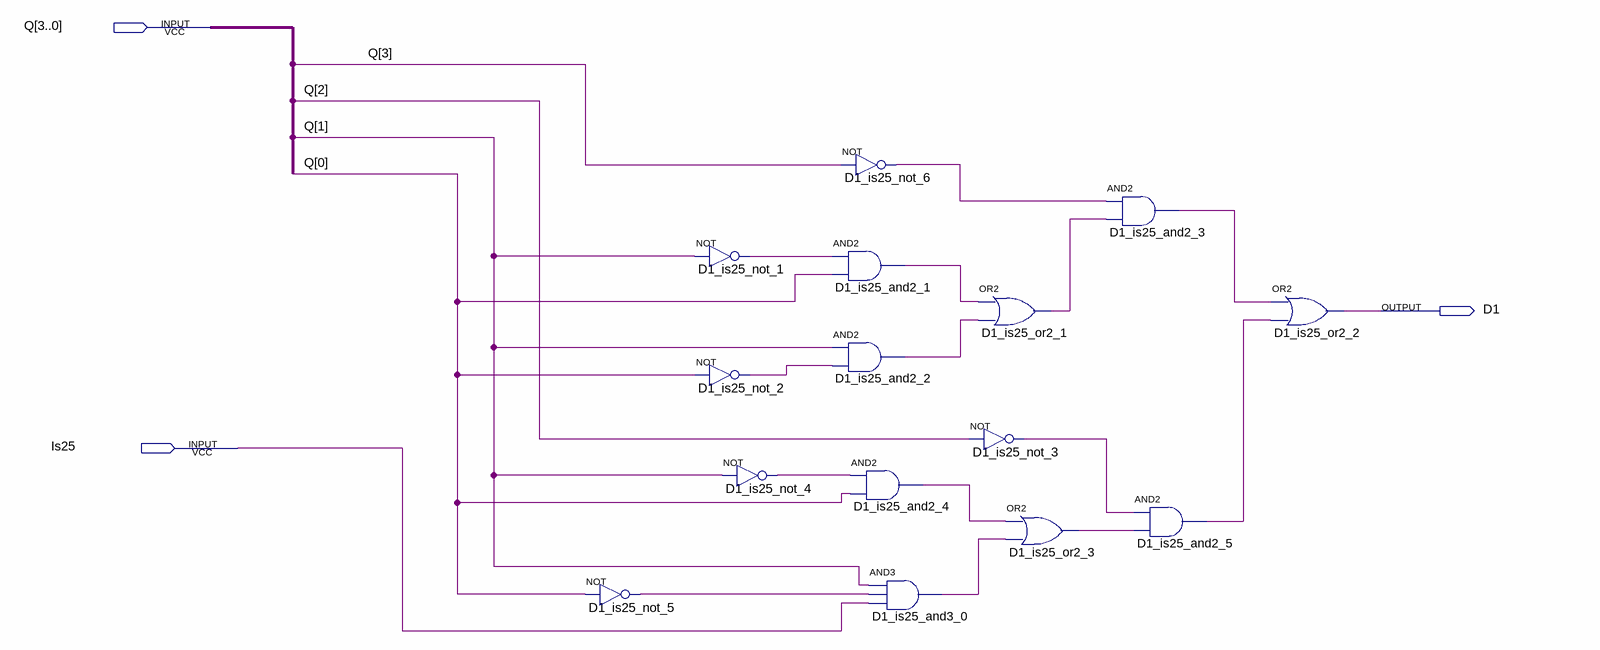
[diagram p0: schematic sheet]
// Quartus schematic D1.bdf as structural Verilog: 15 symbols, 3 pins
module D1 (
  input  [3:0] Q,
  input  Is25,
  output D1
);

  wire D1_is25_and2_1_out, D1_is25_and2_2_out, D1_is25_and2_3_out, D1_is25_and2_4_out, D1_is25_and2_5_out,
       D1_is25_and3_0_out, D1_is25_not_1_out, D1_is25_not_2_out, D1_is25_not_3_out, D1_is25_not_4_out,
       D1_is25_not_5_out, D1_is25_not_6_out, D1_is25_or2_1_out, D1_is25_or2_3_out;

  not D1_is25_not_5 (D1_is25_not_5_out, Q[0]);
  not D1_is25_not_1 (D1_is25_not_1_out, Q[1]);
  not D1_is25_not_2 (D1_is25_not_2_out, Q[0]);
  not D1_is25_not_4 (D1_is25_not_4_out, Q[1]);
  not D1_is25_not_6 (D1_is25_not_6_out, Q[3]);
  and D1_is25_and2_1 (D1_is25_and2_1_out, D1_is25_not_1_out, Q[0]);
  and D1_is25_and2_2 (D1_is25_and2_2_out, Q[1], D1_is25_not_2_out);
  and D1_is25_and2_4 (D1_is25_and2_4_out, D1_is25_not_4_out, Q[0]);
  and D1_is25_and3_0 (D1_is25_and3_0_out, Q[1], D1_is25_not_5_out, Is25);
  or D1_is25_or2_1 (D1_is25_or2_1_out, D1_is25_and2_1_out, D1_is25_and2_2_out);
  not D1_is25_not_3 (D1_is25_not_3_out, Q[2]);
  or D1_is25_or2_3 (D1_is25_or2_3_out, D1_is25_and2_4_out, D1_is25_and3_0_out);
  and D1_is25_and2_3 (D1_is25_and2_3_out, D1_is25_not_6_out, D1_is25_or2_1_out);
  and D1_is25_and2_5 (D1_is25_and2_5_out, D1_is25_not_3_out, D1_is25_or2_3_out);
  or D1_is25_or2_2 (D1, D1_is25_and2_3_out, D1_is25_and2_5_out);
endmodule
